# Altium schematic sheet power.SchDoc
size A3
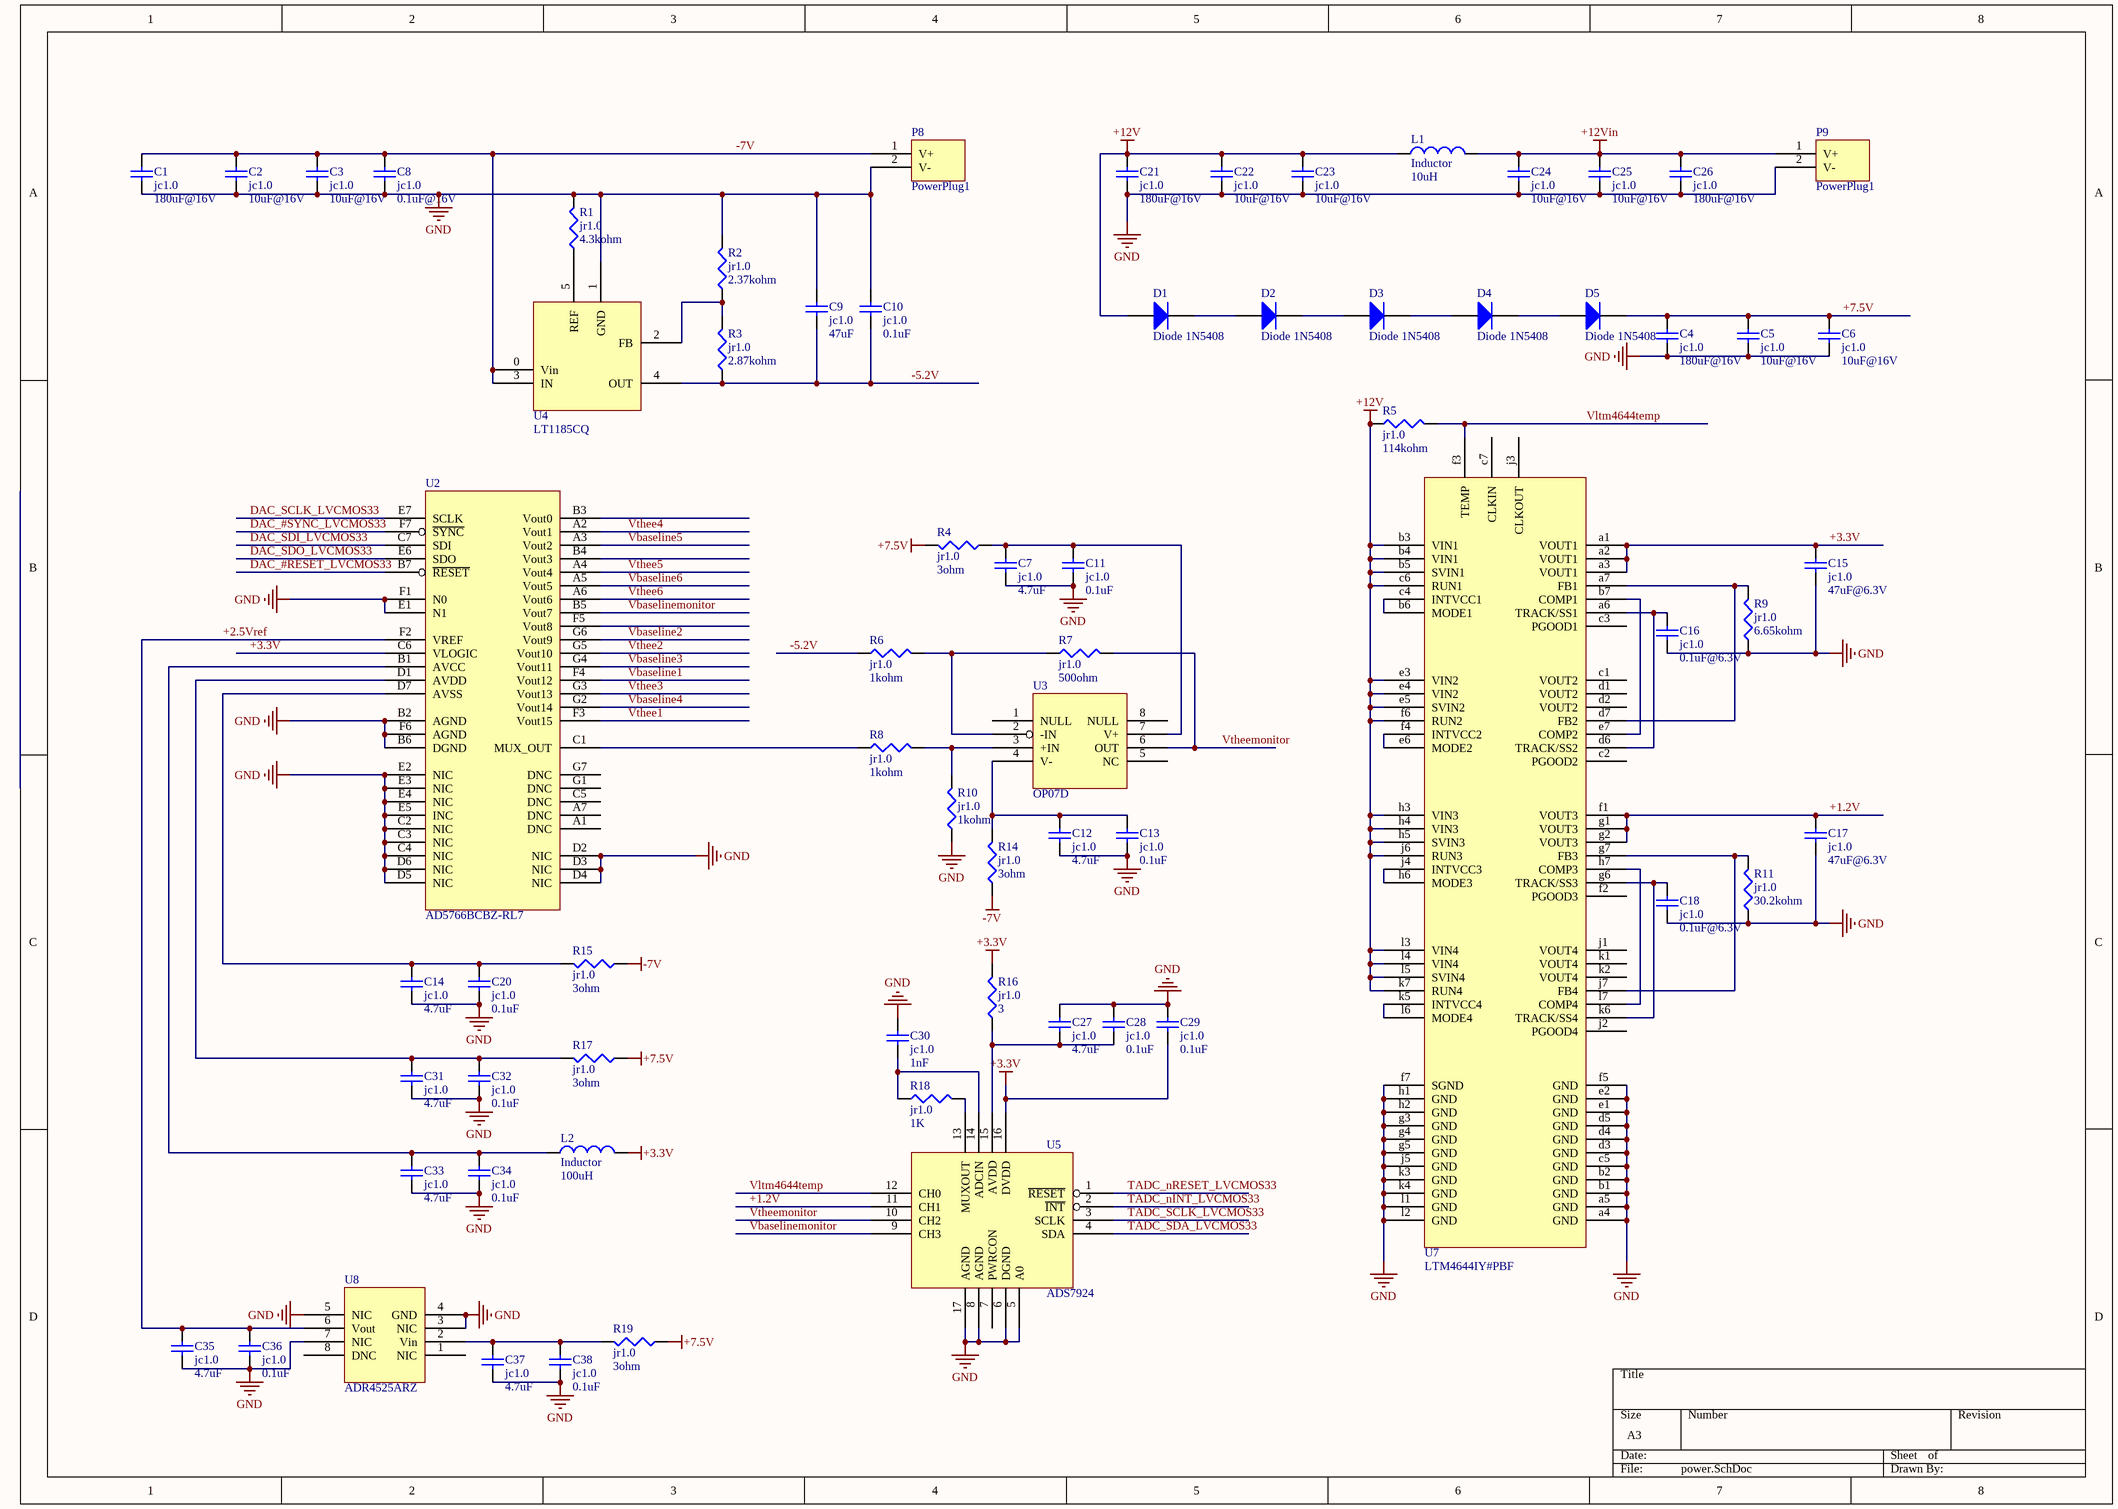
[diagram p0: power.SchDoc]

## Parts
C1  jc1.0  value 180uF@16V  [2220]
C2  jc1.0  value 10uF@16V  [2220]
C3  jc1.0  value 10uF@16V  [2220]
C4  jc1.0  value 180uF@16V  [2220]
C5  jc1.0  value 10uF@16V  [2220]
C6  jc1.0  value 10uF@16V  [2220]
C7  jc1.0  value 4.7uF  [0603]
C8  jc1.0  value 0.1uF@16V  [0805]
C9  jc1.0  value 47uF  [2220]
C10  jc1.0  value 0.1uF  [2220]
C11  jc1.0  value 0.1uF  [0603]
C12  jc1.0  value 4.7uF  [0603]
C13  jc1.0  value 0.1uF  [0603]
C14  jc1.0  value 4.7uF  [0603]
C15  jc1.0  value 47uF@6.3V  [0805]
C16  jc1.0  value 0.1uF@6.3V  [0402]
C17  jc1.0  value 47uF@6.3V  [0805]
C18  jc1.0  value 0.1uF@6.3V  [0402]
C20  jc1.0  value 0.1uF  [0603]
C21  jc1.0  value 180uF@16V  [2220]
C22  jc1.0  value 10uF@16V  [2220]
C23  jc1.0  value 10uF@16V  [2220]
C24  jc1.0  value 10uF@16V  [2220]
C25  jc1.0  value 10uF@16V  [2220]
C26  jc1.0  value 180uF@16V  [2220]
C27  jc1.0  value 4.7uF  [0201]
C28  jc1.0  value 0.1uF  [0201]
C29  jc1.0  value 0.1uF  [0201]
C30  jc1.0  value 1nF  [0201]
C31  jc1.0  value 4.7uF  [0603]
C32  jc1.0  value 0.1uF  [0603]
C33  jc1.0  value 4.7uF  [0603]
C34  jc1.0  value 0.1uF  [0603]
C35  jc1.0  value 4.7uF  [0603]
C36  jc1.0  value 0.1uF  [0603]
C37  jc1.0  value 4.7uF  [0603]
C38  jc1.0  value 0.1uF  [0603]
D1  Diode 1N5408  [DO-201AD]
D2  Diode 1N5408  [DO-201AD]
D3  Diode 1N5408  [DO-201AD]
D4  Diode 1N5408  [DO-201AD]
D5  Diode 1N5408  [DO-201AD]
L1  Inductor  value 10uH  [AXIAL0.3 - 35]
L2  Inductor  value 100uH  [0805]
P8  PowerPlug1  [POWERPLUG1]
P9  PowerPlug1  [POWERPLUG1]
R1  jr1.0  value 4.3kohm  [0805]
R2  jr1.0  value 2.37kohm  [0805]
R3  jr1.0  value 2.87kohm  [0805]
R4  jr1.0  value 3ohm  [0603]
R5  jr1.0  value 114kohm  [0402]
R6  jr1.0  value 1kohm  [0603]
R7  jr1.0  value 500ohm  [0603]
R8  jr1.0  value 1kohm  [0603]
R9  jr1.0  value 6.65kohm  [0805]
R10  jr1.0  value 1kohm  [0603]
R11  jr1.0  value 30.2kohm  [0805]
R14  jr1.0  value 3ohm  [0603]
R15  jr1.0  value 3ohm  [0603]
R16  jr1.0  value 3  [0201]
R17  jr1.0  value 3ohm  [0603]
R18  jr1.0  value 1K  [0201]
R19  jr1.0  value 3ohm  [0603]
U2  AD5766BCBZ-RL7  [WLCSP-49]
U3  OP07D  [R8(SOP127P600-8N)]
U4  LT1185CQ  [LP5 - 1185]
U5  ADS7924  [QFN50P300X300X80_HS-17N]
U7  LTM4644IY#PBF  [BGA77C127P7X11_900X1500X521]
U8  ADR4525ARZ  [R8(SOP127P600-8N)]

## Nets
+3.3V: C15.2 C29.1 L2.2 R16.2 U2.C6(VLOGIC) U5.16(DVDD) U7.a1(VOUT1) U7.a2(VOUT1) U7.a3(VOUT1)
+7.5V: C4.2 C5.2 C6.2 D5.2(K) R4.2 R17.1 R19.1
+12V: C21.2 C22.2 C23.2 D1.1(A) L1.1 R5.1 U7.b3(VIN1) U7.b4(VIN1) U7.b5(SVIN1) U7.c6(RUN1) U7.e3(VIN2) U7.e4(VIN2) U7.e5(SVIN2) U7.f6(RUN2) U7.h3(VIN3) U7.h4(VIN3) U7.h5(SVIN3) U7.j6(RUN3) U7.k7(RUN4) U7.l3(VIN4) U7.l4(VIN4) U7.l5(SVIN4)
+12Vin: C24.2 C25.2 C26.2 L1.2 P9.1(V+)
-7V: C1.2 C2.2 C3.2 C8.2 P8.1(V+) R14.1 R15.1 U4.0(Vin) U4.3(IN)
GND: C1.1 C2.1 C3.1 C4.1 C5.1 C6.1 C7.1 C8.1 C9.2 C10.2 C11.1 C12.1 C13.1 C14.1 C15.1 C16.1 C17.1 C18.1 C20.1 C21.1 C22.1 C23.1 C24.1 C25.1 C26.1 C27.2 C28.2 C29.2 C30.2 C31.1 C32.1 C33.1 C34.1 C35.1 C36.1 C37.1 C38.1 P8.2(V-) P9.2(V-) R1.2 R2.2 R9.1 R10.1 R11.1 U2.B2(AGND) U2.B6(DGND) U2.C2(NIC) U2.C3(NIC) U2.C4(NIC) U2.D2(NIC) U2.D3(NIC) U2.D4(NIC) U2.D5(NIC) U2.D6(NIC) U2.E1(N1) U2.E2(NIC) U2.E3(NIC) U2.E4(NIC) U2.E5(INC) U2.F1(N0) U2.F6(AGND) U4.1(GND) U5.5(A0) U5.6(DGND) U5.8(AGND) U5.17(AGND) U7.a4(GND) U7.a5(GND) U7.b1(GND) U7.b2(GND) U7.c5(GND) U7.d3(GND) U7.d4(GND) U7.d5(GND) U7.e1(GND) U7.e2(GND) U7.f5(GND) U7.f7(SGND) U7.g3(GND) U7.g4(GND) U7.g5(GND) U7.h1(GND) U7.h2(GND) U7.j5(GND) U7.k3(GND) U7.k4(GND) U7.l1(GND) U7.l2(GND) U8.3(NIC) U8.4(GND) U8.5(NIC) U8.7(NIC)
+1.2V: C17.2 U5.11(CH1) U7.f1(VOUT3) U7.g1(VOUT3) U7.g2(VOUT3)
+2.5Vref: C35.2 C36.2 U2.F2(VREF) U8.6(Vout)
-5.2V: C9.1 C10.1 R3.1 R6.1 U4.4(OUT)
DAC_#RESET_LVCMOS33: U2.B7(~{RESET})
DAC_#SYNC_LVCMOS33: U2.F7(~{SYNC})
DAC_SCLK_LVCMOS33: U2.E7(SCLK)
DAC_SDI_LVCMOS33: U2.C7(SDI)
DAC_SDO_LVCMOS33: U2.E6(SDO)
TADC_nINT_LVCMOS33: U5.2(~{INT})
TADC_nRESET_LVCMOS33: U5.1(~{RESET})
TADC_SCLK_LVCMOS33: U5.3(SCLK)
TADC_SDA_LVCMOS33: U5.4(SDA)
Vbaseline1: U2.F4(Vout12)
Vbaseline2: U2.G6(Vout9)
Vbaseline3: U2.G4(Vout11)
Vbaseline4: U2.G2(Vout14)
Vbaseline5: U2.A3(Vout2)
Vbaseline6: U2.A5(Vout5)
Vbaselinemonitor: U2.B5(Vout7) U5.9(CH3)
Vltm4644temp: R5.2 U5.12(CH0) U7.f3(TEMP)
Vthee1: U2.F3(Vout15)
Vthee2: U2.G5(Vout10)
Vthee3: U2.G3(Vout13)
Vthee4: U2.A2(Vout1)
Vthee5: U2.A4(Vout4)
Vthee6: U2.A6(Vout6)
Vtheemonitor: R7.2 U3.6(OUT) U5.10(CH2)
NetC7_2: C7.2 C11.2 R4.1 U3.7(V+)
NetC12_2: C12.2 C13.2 R14.2 U3.4(V-)
NetC14_2: C14.2 C20.2 R15.2 U2.D7(AVSS)
NetC16_2: C16.2 U7.a6(TRACK/SS1) U7.d6(TRACK/SS2)
NetC18_2: C18.2 U7.g6(TRACK/SS3) U7.k6(TRACK/SS4)
NetC27_1: C27.1 C28.1 R16.1 U5.15(AVDD)
NetC30_1: C30.1 R18.1 U5.14(ADCIN)
NetC31_2: C31.2 C32.2 R17.2 U2.D1(AVDD)
NetC33_2: C33.2 C34.2 L2.1 U2.B1(AVCC)
NetC37_2: C37.2 C38.2 R19.2 U8.2(Vin)
NetD1_2: D1.2(K) D2.1(A)
NetD2_2: D2.2(K) D3.1(A)
NetD3_2: D3.2(K) D4.1(A)
NetD4_2: D4.2(K) D5.1(A)
NetR1_1: R1.1 U4.5(REF)
NetR2_1: R2.1 R3.2 U4.2(FB)
NetR6_2: R6.2 R7.1 U3.2(-IN)
NetR8_1: R8.1 U2.C1(MUX_OUT)
NetR8_2: R8.2 R10.2 U3.3(+IN)
NetR9_2: R9.2 U7.a7(FB1) U7.d7(FB2)
NetR11_2: R11.2 U7.g7(FB3) U7.j7(FB4)
NetR18_2: R18.2 U5.13(MUXOUT)
NetU7_b6: U7.b6(MODE1) U7.c4(INTVCC1)
NetU7_b7: U7.b7(COMP1) U7.e7(COMP2)
NetU7_e6: U7.e6(MODE2) U7.f4(INTVCC2)
NetU7_h6: U7.h6(MODE3) U7.j4(INTVCC3)
NetU7_h7: U7.h7(COMP3) U7.l7(COMP4)
NetU7_k5: U7.k5(INTVCC4) U7.l6(MODE4)

Not connected (* = marked no-connect by the designer): U2 A1(DNC) A7(DNC) B3(Vout0) B4(Vout3) C5(DNC) F5(Vout8) G1(DNC) G7(DNC); U3 1(NULL) 5(NC) 8(NULL); U5 7(PWRCON); U7 c1(VOUT2) c2(PGOOD2) c3(PGOOD1) c7(CLKIN) d1(VOUT2) d2(VOUT2) f2(PGOOD3) j1(VOUT4) j2(PGOOD4) j3(CLKOUT) k1(VOUT4) k2(VOUT4); U8 1(NIC) 8(DNC)

## Library data of the parts
C1-C18 C20-C38 = Cap: Capacitor; Published: 8-Jun-2000; LatestRevisionDate: 17-Jul-2002; LatestRevisionNote: Re-released for DXP Platform.; PackageReference: RAD-0.3; Publisher: Altium Limited
D1-D5 = Diode 1N5408: 3 Amp Medium Power Silicon Rectifier Diode; Published: 8-Jun-2000; LatestRevisionDate: 17-Jul-2002; LatestRevisionNote: Re-released for DXP Platform.; DatasheetVersion: Aug-1984; PackageReference: DO-201AD; Publisher: Altium Limited; PackageDescription: Diode, Axial; Body 9.5 x 5.3 mm (LxDia. max), Lead Dia. 1.32 mm (max); ComponentLink1Description: Manufacturer Link; ComponentLink1URL: http://www.irf.com/
L1 L2 = Inductor: Code_IEC: 1005; Published: 8-Jun-2000; LatestRevisionDate: 17-Jul-2002; LatestRevisionNote: Re-released for DXP Platform.; PackageReference: 0402-A; Publisher: Altium Limited; Code_JEITA: 0402
R1-R11 R14-R19 = Res: Resistor; Published: 8-Jun-2000; LatestRevisionDate: 04-Mar-2005; LatestRevisionNote: PCB Footprint replaced.; PackageReference: J1-0603; Publisher: Altium Limited
U8 = ADR4525BRZ